# Altium schematic sheet top.SchDoc
size A
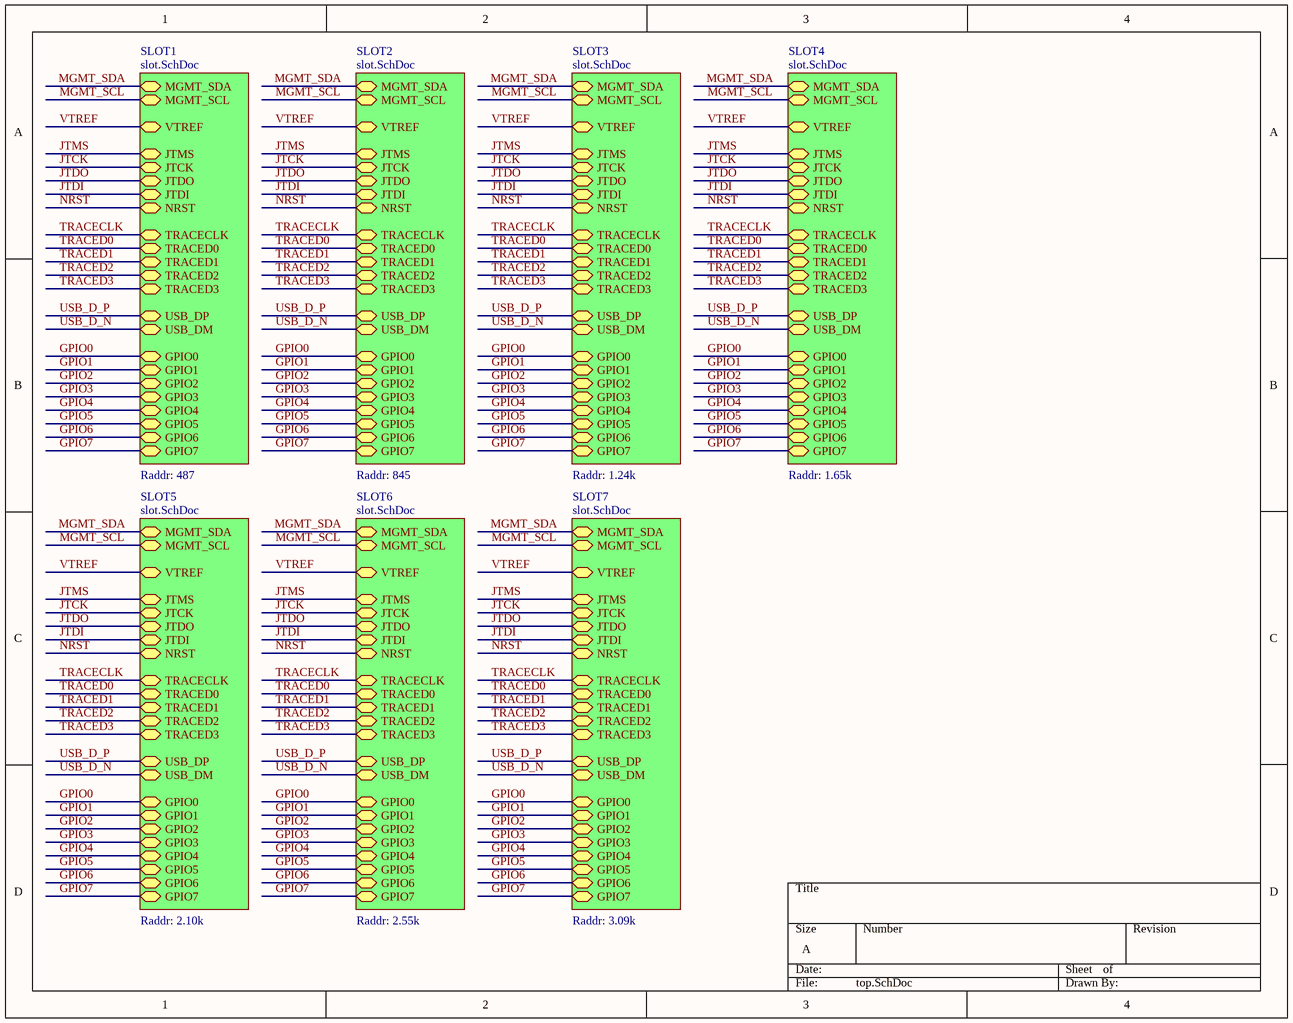
[diagram p0: top.SchDoc]

## Sub-sheets
SLOT1 = slot.SchDoc: JTCK (bidir), GPIO1 (bidir), GPIO0 (bidir), TRACED0 (bidir), GPIO6 (bidir), USB_DP (bidir), NRST (bidir), USB_DM (bidir), MGMT_SDA (bidir), GPIO5 (bidir), JTDO (bidir), GPIO7 (bidir), GPIO3 (bidir), VTREF (bidir), TRACED2 (bidir), GPIO2 (bidir), TRACECLK (bidir), GPIO4 (bidir), MGMT_SCL (bidir), JTMS (bidir), TRACED3 (bidir), TRACED1 (bidir), JTDI (bidir)  | Raddr: 487
SLOT2 = slot.SchDoc: JTCK (bidir), GPIO1 (bidir), GPIO0 (bidir), TRACED0 (bidir), GPIO6 (bidir), USB_DP (bidir), NRST (bidir), USB_DM (bidir), MGMT_SDA (bidir), GPIO5 (bidir), JTDO (bidir), GPIO7 (bidir), GPIO3 (bidir), VTREF (bidir), TRACED2 (bidir), GPIO2 (bidir), TRACECLK (bidir), GPIO4 (bidir), MGMT_SCL (bidir), JTMS (bidir), TRACED3 (bidir), TRACED1 (bidir), JTDI (bidir)  | Raddr: 845
SLOT3 = slot.SchDoc: JTCK (bidir), GPIO1 (bidir), GPIO0 (bidir), TRACED0 (bidir), GPIO6 (bidir), USB_DP (bidir), NRST (bidir), USB_DM (bidir), MGMT_SDA (bidir), GPIO5 (bidir), JTDO (bidir), GPIO7 (bidir), GPIO3 (bidir), VTREF (bidir), TRACED2 (bidir), GPIO2 (bidir), TRACECLK (bidir), GPIO4 (bidir), MGMT_SCL (bidir), JTMS (bidir), TRACED3 (bidir), TRACED1 (bidir), JTDI (bidir)  | Raddr: 1.24k
SLOT4 = slot.SchDoc: JTCK (bidir), GPIO1 (bidir), GPIO0 (bidir), TRACED0 (bidir), GPIO6 (bidir), USB_DP (bidir), NRST (bidir), USB_DM (bidir), MGMT_SDA (bidir), GPIO5 (bidir), JTDO (bidir), GPIO7 (bidir), GPIO3 (bidir), VTREF (bidir), TRACED2 (bidir), GPIO2 (bidir), TRACECLK (bidir), GPIO4 (bidir), MGMT_SCL (bidir), JTMS (bidir), TRACED3 (bidir), TRACED1 (bidir), JTDI (bidir)  | Raddr: 1.65k
SLOT5 = slot.SchDoc: JTCK (bidir), GPIO1 (bidir), GPIO0 (bidir), TRACED0 (bidir), GPIO6 (bidir), USB_DP (bidir), NRST (bidir), USB_DM (bidir), MGMT_SDA (bidir), GPIO5 (bidir), JTDO (bidir), GPIO7 (bidir), GPIO3 (bidir), VTREF (bidir), TRACED2 (bidir), GPIO2 (bidir), TRACECLK (bidir), GPIO4 (bidir), MGMT_SCL (bidir), JTMS (bidir), TRACED3 (bidir), TRACED1 (bidir), JTDI (bidir)  | Raddr: 2.10k
SLOT6 = slot.SchDoc: JTCK (bidir), GPIO1 (bidir), GPIO0 (bidir), TRACED0 (bidir), GPIO6 (bidir), USB_DP (bidir), NRST (bidir), USB_DM (bidir), MGMT_SDA (bidir), GPIO5 (bidir), JTDO (bidir), GPIO7 (bidir), GPIO3 (bidir), VTREF (bidir), TRACED2 (bidir), GPIO2 (bidir), TRACECLK (bidir), GPIO4 (bidir), MGMT_SCL (bidir), JTMS (bidir), TRACED3 (bidir), TRACED1 (bidir), JTDI (bidir)  | Raddr: 2.55k
SLOT7 = slot.SchDoc: JTCK (bidir), GPIO1 (bidir), GPIO0 (bidir), TRACED0 (bidir), GPIO6 (bidir), USB_DP (bidir), NRST (bidir), USB_DM (bidir), MGMT_SDA (bidir), GPIO5 (bidir), JTDO (bidir), GPIO7 (bidir), GPIO3 (bidir), VTREF (bidir), TRACED2 (bidir), GPIO2 (bidir), TRACECLK (bidir), GPIO4 (bidir), MGMT_SCL (bidir), JTMS (bidir), TRACED3 (bidir), TRACED1 (bidir), JTDI (bidir)  | Raddr: 3.09k

## Nets
GPIO0: sheet SLOT1/GPIO0, sheet SLOT2/GPIO0, sheet SLOT3/GPIO0, sheet SLOT4/GPIO0, sheet SLOT5/GPIO0, sheet SLOT6/GPIO0, sheet SLOT7/GPIO0
GPIO1: sheet SLOT1/GPIO1, sheet SLOT2/GPIO1, sheet SLOT3/GPIO1, sheet SLOT4/GPIO1, sheet SLOT5/GPIO1, sheet SLOT6/GPIO1, sheet SLOT7/GPIO1
GPIO2: sheet SLOT1/GPIO2, sheet SLOT2/GPIO2, sheet SLOT3/GPIO2, sheet SLOT4/GPIO2, sheet SLOT5/GPIO2, sheet SLOT6/GPIO2, sheet SLOT7/GPIO2
GPIO3: sheet SLOT1/GPIO3, sheet SLOT2/GPIO3, sheet SLOT3/GPIO3, sheet SLOT4/GPIO3, sheet SLOT5/GPIO3, sheet SLOT6/GPIO3, sheet SLOT7/GPIO3
GPIO4: sheet SLOT1/GPIO4, sheet SLOT2/GPIO4, sheet SLOT3/GPIO4, sheet SLOT4/GPIO4, sheet SLOT5/GPIO4, sheet SLOT6/GPIO4, sheet SLOT7/GPIO4
GPIO5: sheet SLOT1/GPIO5, sheet SLOT2/GPIO5, sheet SLOT3/GPIO5, sheet SLOT4/GPIO5, sheet SLOT5/GPIO5, sheet SLOT6/GPIO5, sheet SLOT7/GPIO5
GPIO6: sheet SLOT1/GPIO6, sheet SLOT2/GPIO6, sheet SLOT3/GPIO6, sheet SLOT4/GPIO6, sheet SLOT5/GPIO6, sheet SLOT6/GPIO6, sheet SLOT7/GPIO6
GPIO7: sheet SLOT1/GPIO7, sheet SLOT2/GPIO7, sheet SLOT3/GPIO7, sheet SLOT4/GPIO7, sheet SLOT5/GPIO7, sheet SLOT6/GPIO7, sheet SLOT7/GPIO7
JTCK: sheet SLOT1/JTCK, sheet SLOT2/JTCK, sheet SLOT3/JTCK, sheet SLOT4/JTCK, sheet SLOT5/JTCK, sheet SLOT6/JTCK, sheet SLOT7/JTCK
JTDI: sheet SLOT1/JTDI, sheet SLOT2/JTDI, sheet SLOT3/JTDI, sheet SLOT4/JTDI, sheet SLOT5/JTDI, sheet SLOT6/JTDI, sheet SLOT7/JTDI
JTDO: sheet SLOT1/JTDO, sheet SLOT2/JTDO, sheet SLOT3/JTDO, sheet SLOT4/JTDO, sheet SLOT5/JTDO, sheet SLOT6/JTDO, sheet SLOT7/JTDO
JTMS: sheet SLOT1/JTMS, sheet SLOT2/JTMS, sheet SLOT3/JTMS, sheet SLOT4/JTMS, sheet SLOT5/JTMS, sheet SLOT6/JTMS, sheet SLOT7/JTMS
MGMT_SCL: sheet SLOT1/MGMT_SCL, sheet SLOT2/MGMT_SCL, sheet SLOT3/MGMT_SCL, sheet SLOT4/MGMT_SCL, sheet SLOT5/MGMT_SCL, sheet SLOT6/MGMT_SCL, sheet SLOT7/MGMT_SCL
MGMT_SDA: sheet SLOT1/MGMT_SDA, sheet SLOT2/MGMT_SDA, sheet SLOT3/MGMT_SDA, sheet SLOT4/MGMT_SDA, sheet SLOT5/MGMT_SDA, sheet SLOT6/MGMT_SDA, sheet SLOT7/MGMT_SDA
NRST: sheet SLOT1/NRST, sheet SLOT2/NRST, sheet SLOT3/NRST, sheet SLOT4/NRST, sheet SLOT5/NRST, sheet SLOT6/NRST, sheet SLOT7/NRST
TRACECLK: sheet SLOT1/TRACECLK, sheet SLOT2/TRACECLK, sheet SLOT3/TRACECLK, sheet SLOT4/TRACECLK, sheet SLOT5/TRACECLK, sheet SLOT6/TRACECLK, sheet SLOT7/TRACECLK
TRACED0: sheet SLOT1/TRACED0, sheet SLOT2/TRACED0, sheet SLOT3/TRACED0, sheet SLOT4/TRACED0, sheet SLOT5/TRACED0, sheet SLOT6/TRACED0, sheet SLOT7/TRACED0
TRACED1: sheet SLOT1/TRACED1, sheet SLOT2/TRACED1, sheet SLOT3/TRACED1, sheet SLOT4/TRACED1, sheet SLOT5/TRACED1, sheet SLOT6/TRACED1, sheet SLOT7/TRACED1
TRACED2: sheet SLOT1/TRACED2, sheet SLOT2/TRACED2, sheet SLOT3/TRACED2, sheet SLOT4/TRACED2, sheet SLOT5/TRACED2, sheet SLOT6/TRACED2, sheet SLOT7/TRACED2
TRACED3: sheet SLOT1/TRACED3, sheet SLOT2/TRACED3, sheet SLOT3/TRACED3, sheet SLOT4/TRACED3, sheet SLOT5/TRACED3, sheet SLOT6/TRACED3, sheet SLOT7/TRACED3
USB_D_N: sheet SLOT1/USB_DM, sheet SLOT2/USB_DM, sheet SLOT3/USB_DM, sheet SLOT4/USB_DM, sheet SLOT5/USB_DM, sheet SLOT6/USB_DM, sheet SLOT7/USB_DM
USB_D_P: sheet SLOT1/USB_DP, sheet SLOT2/USB_DP, sheet SLOT3/USB_DP, sheet SLOT4/USB_DP, sheet SLOT5/USB_DP, sheet SLOT6/USB_DP, sheet SLOT7/USB_DP
VTREF: sheet SLOT1/VTREF, sheet SLOT2/VTREF, sheet SLOT3/VTREF, sheet SLOT4/VTREF, sheet SLOT5/VTREF, sheet SLOT6/VTREF, sheet SLOT7/VTREF